# EasyEDA Pro project ProPrj_stm32的实验室报警系统设计与实现_2026-04-30.epro

# Schematic Schematic1
Assembly Variant: Basic; Board Name: Board1; Create Date: 2026-03-08; Page Name: P1; Project Name: stm32的实验室报警系统设计与实现; Schematic Name: Schematic1; Update Date: 2026-03-08; BladeWidth: 10; Company: 嘉立创EDA; Page Size: A4; RegionStart: 1; ShowBorder: 1; TitleBlock: 1; TitleBlockPosition: 3; Version: V1.0; XRegionCount: 6; YRegionCount: 4
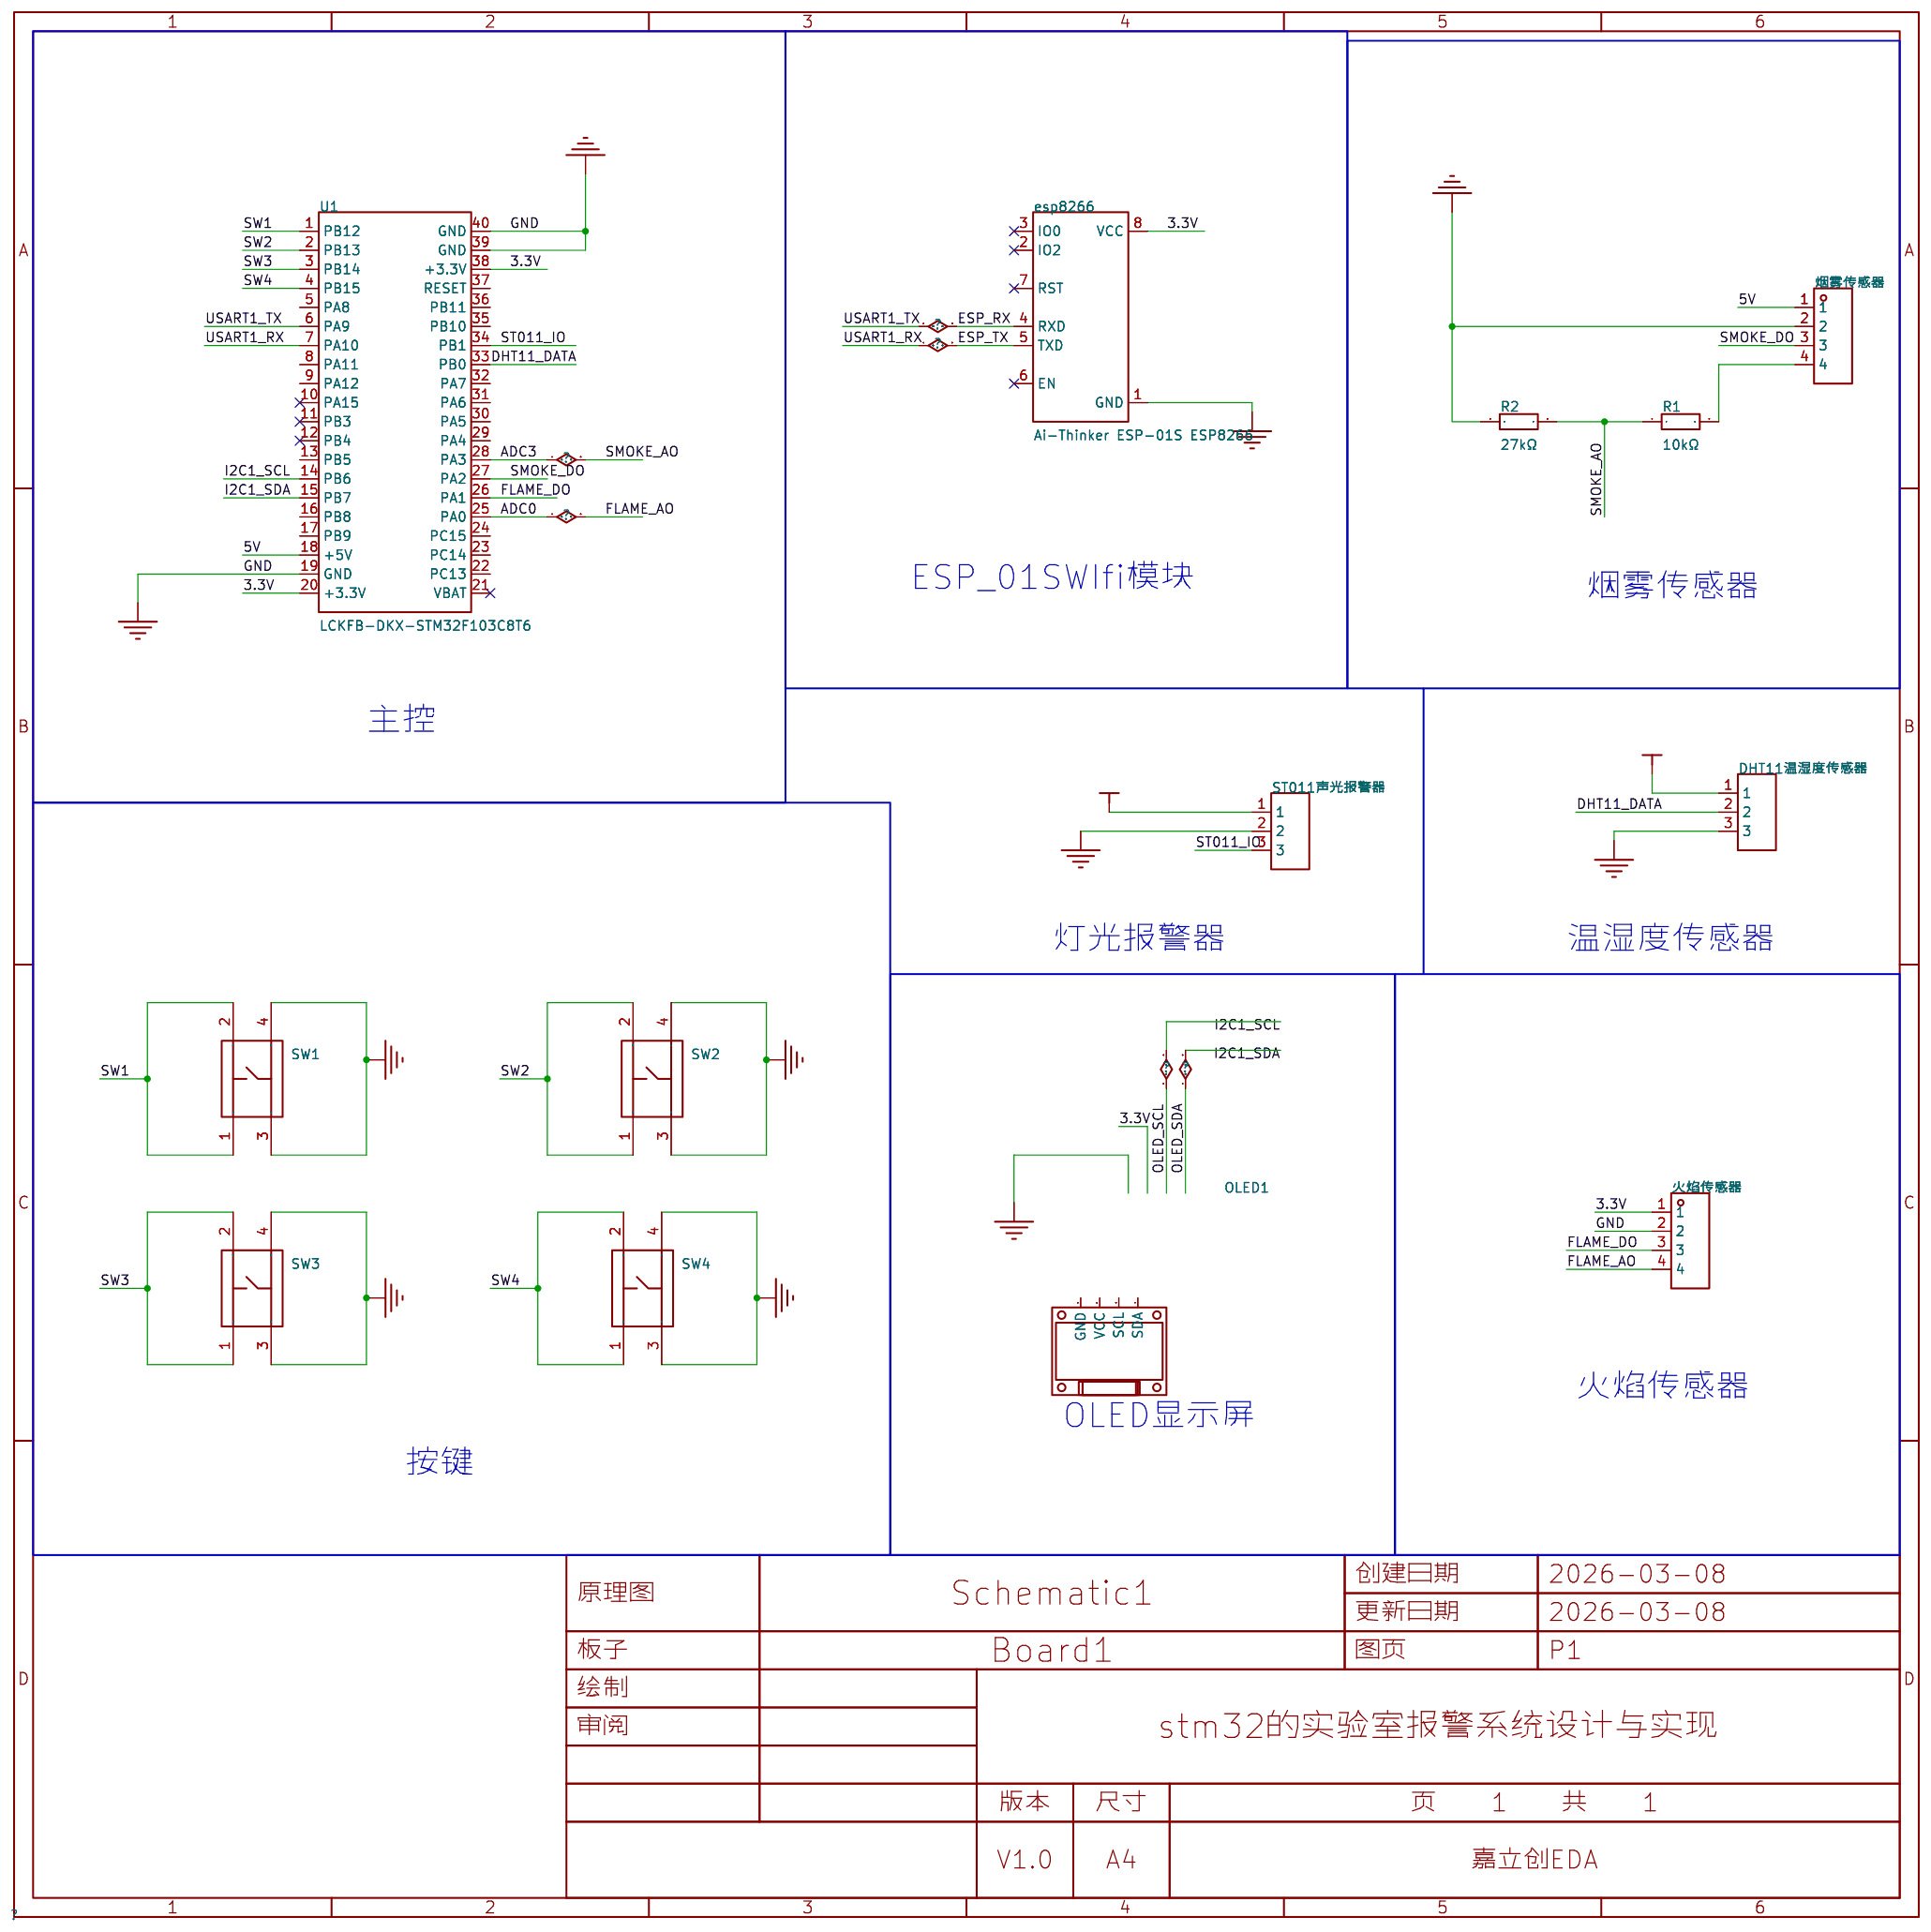
[diagram p0: schematic sheet]

## Parts
DHT11温湿度传感器  -  [HDR-TH_3P-P2.54-V-F]
esp8266  Ai-Thinker ESP-01S ESP8266  [WIFIM-TH_8P-L24.7-W14.4-P2.54]
OLED1  -  [0.96OLED_4P]
R1  10kΩ  [R0805]
R2  27kΩ  [R0805]
ST011声光报警器  -  [HDR-TH_3P-P2.54-V-F]
SW1  K2-1102DP-C4SW-04  [KEY-TH_4P-L6.0-W6.0-P4.50-LS6.50]
SW2  K2-1102DP-C4SW-04  [KEY-TH_4P-L6.0-W6.0-P4.50-LS6.50]
SW3  K2-1102DP-C4SW-04  [KEY-TH_4P-L6.0-W6.0-P4.50-LS6.50]
SW4  K2-1102DP-C4SW-04  [KEY-TH_4P-L6.0-W6.0-P4.50-LS6.50]
U1  LCKFB-DKX-STM32F103C8T6  [CONN-TH_L53.3-W22.9_STM32F103C8T6-CARD]
火焰传感器  -  [HDR-TH_4P-P2.54-V-F]
烟雾传感器  -  [HDR-TH_4P-P2.54-V-F]

## Library data of the parts
DHT11温湿度传感器 ST011声光报警器 = HDR-F_2.54_1x3P: Supplier Part: C541850; Supplier Footprint: 插件
esp8266 = Ai-Thinker ESP-01S ESP8266: Supplier Part: C17606792; Manufacturer: Ai-Thinker(安信可); JLCPCB Part Class: Extended Part; Datasheet: https://item.szlcsc.com/datasheet/Ai-Thinker%2520ESP-01S%2520ESP8266/18736031.html; Supplier: LCSC
OLED1 = 0.96OLED模块_4P: Supplier Footprint: 插件
R1 R2 = 0805W8F1002T5E_C17414: 电阻类型:厚膜电阻;阻值:10kΩ;精度:±1%;功率:125mW;工作电压:150V;温度系数:±100ppm/℃;; LCSC Part Name: 10kΩ ±1% 125mW 厚膜电阻; Supplier Part: C17414; Manufacturer: UNI-ROYAL(厚声); Manufacturer Part: 0805W8F1002T5E; Supplier Footprint: 0805; JLCPCB Part Class: Basic Part; Datasheet: https://item.szlcsc.com/datasheet/0805W8F1002T5E/18102.html; Supplier: LCSC; Type: 厚膜电阻; Tolerance: ±1%; Power(Watts): 125mW; Voltage-Supply(Max): 150V; Temperature Coefficient: ±100ppm/℃; Operating Temperature: -55℃~+155℃
SW1-SW4 = K2-1102DP-C4SW-04: 电路结构:单刀单掷;按钮形状:圆形按钮;作用力:2.5N;安装方式:直插;开关长度:6mm;开关宽度:6mm;开关高度:5mm;触点电流:50mA;额定电压:12V;带灯:-;工作寿命:10万次;; LCSC Part Name: 轻触按键开关6*6*5; Supplier Part: C110153; Manufacturer: 韩国韩荣; Supplier Footprint: 插件-4P,6x6mm; JLCPCB Part Class: Extended Part; Datasheet: https://item.szlcsc.com/datasheet/K2-1102DP-C4SW-04/111374.html; Supplier: LCSC; Circuit: 单刀单掷; Actuator Style: 圆形按钮; Operating Force: 2.5N; Mounting Type: 直插; Length: 6mm; Width: 6mm; Switch Height: 5mm; Contact Current: 50mA; Voltage Rating: 12V; Life: 10万次; Operating Temperature: -25℃~+85℃
U1 = LCKFB-DKX-STM32F103C8T6: 搭载Contex M3内核,程序存储容量64KB,RAM总容量20KB,最高72MHz主频,提供高效的计算能力和稳定的运行环境。; LCSC Part Name: 立创·地阔星-STM32F103C8T6开发板; Supplier Part: C22396880; Manufacturer: 立创开发板; JLCPCB Part Class: Extended Part; Datasheet: https://item.szlcsc.com/datasheet/LCKFB-DKX-STM32F103C8T6/24005615.html; Supplier: LCSC
火焰传感器 烟雾传感器 = HDR-F_2.54_1x4P: Supplier Part: C2718488; Supplier Footprint: 插件

## Nets
3.3V: DHT11温湿度传感器.1 esp8266.8(VCC) ST011声光报警器.1 U1.20(+3.3V) U1.38(+3.3V) 火焰传感器.1
5V: U1.18(+5V) 烟雾传感器.1
GND: DHT11温湿度传感器.3 esp8266.1(GND) R2.1 ST011声光报警器.2 SW1.3 SW1.4 SW2.3 SW2.4 SW3.3 SW3.4 SW4.3 SW4.4 U1.19(GND) U1.39(GND) U1.40(GND) 火焰传感器.2 烟雾传感器.2
ADC0: U1.25(PA0) 火焰传感器.4
ADC3: R1.1 R2.2 U1.28(PA3)
DHT11_DATA: DHT11温湿度传感器.2 U1.33(PB0)
ESP_RX: esp8266.4(RXD) U1.6(PA9)
ESP_TX: esp8266.5(TXD) U1.7(PA10)
FLAME_DO: U1.26(PA1) 火焰传感器.3
I2C1_SCL: U1.14(PB6)
I2C1_SDA: U1.15(PB7)
SMOKE_DO: U1.27(PA2) 烟雾传感器.3
ST011_IO: ST011声光报警器.3 U1.34(PB1)
SW1: SW1.1 SW1.2 U1.1(PB12)
SW2: SW2.1 SW2.2 U1.2(PB13)
SW3: SW3.1 SW3.2 U1.3(PB14)
SW4: SW4.1 SW4.2 U1.4(PB15)
$1N30: R1.2 烟雾传感器.4

Not connected (* = marked no-connect by the designer): esp8266 2(IO2)* 3(IO0)* 6(EN)* 7(RST)*; OLED1 1(GND) 2(VCC) 3(SCL) 4(SDA); U1 5(PA8) 8(PA11) 9(PA12) 10(PA15)* 11(PB3)* 12(PB4)* 13(PB5) 16(PB8) 17(PB9) 21(VBAT)* 22(PC13) 23(PC14) 24(PC15) 29(PA4) 30(PA5) 31(PA6) 32(PA7) 35(PB10) 36(PB11) 37(RESET)

## Notes on the sheet
- ESP_01SWIfi模块
- 烟雾传感器
- 主控
- 灯光报警器
- 温湿度传感器
- 火焰传感器
- OLED显示屏
- 按键

# Board PCB1
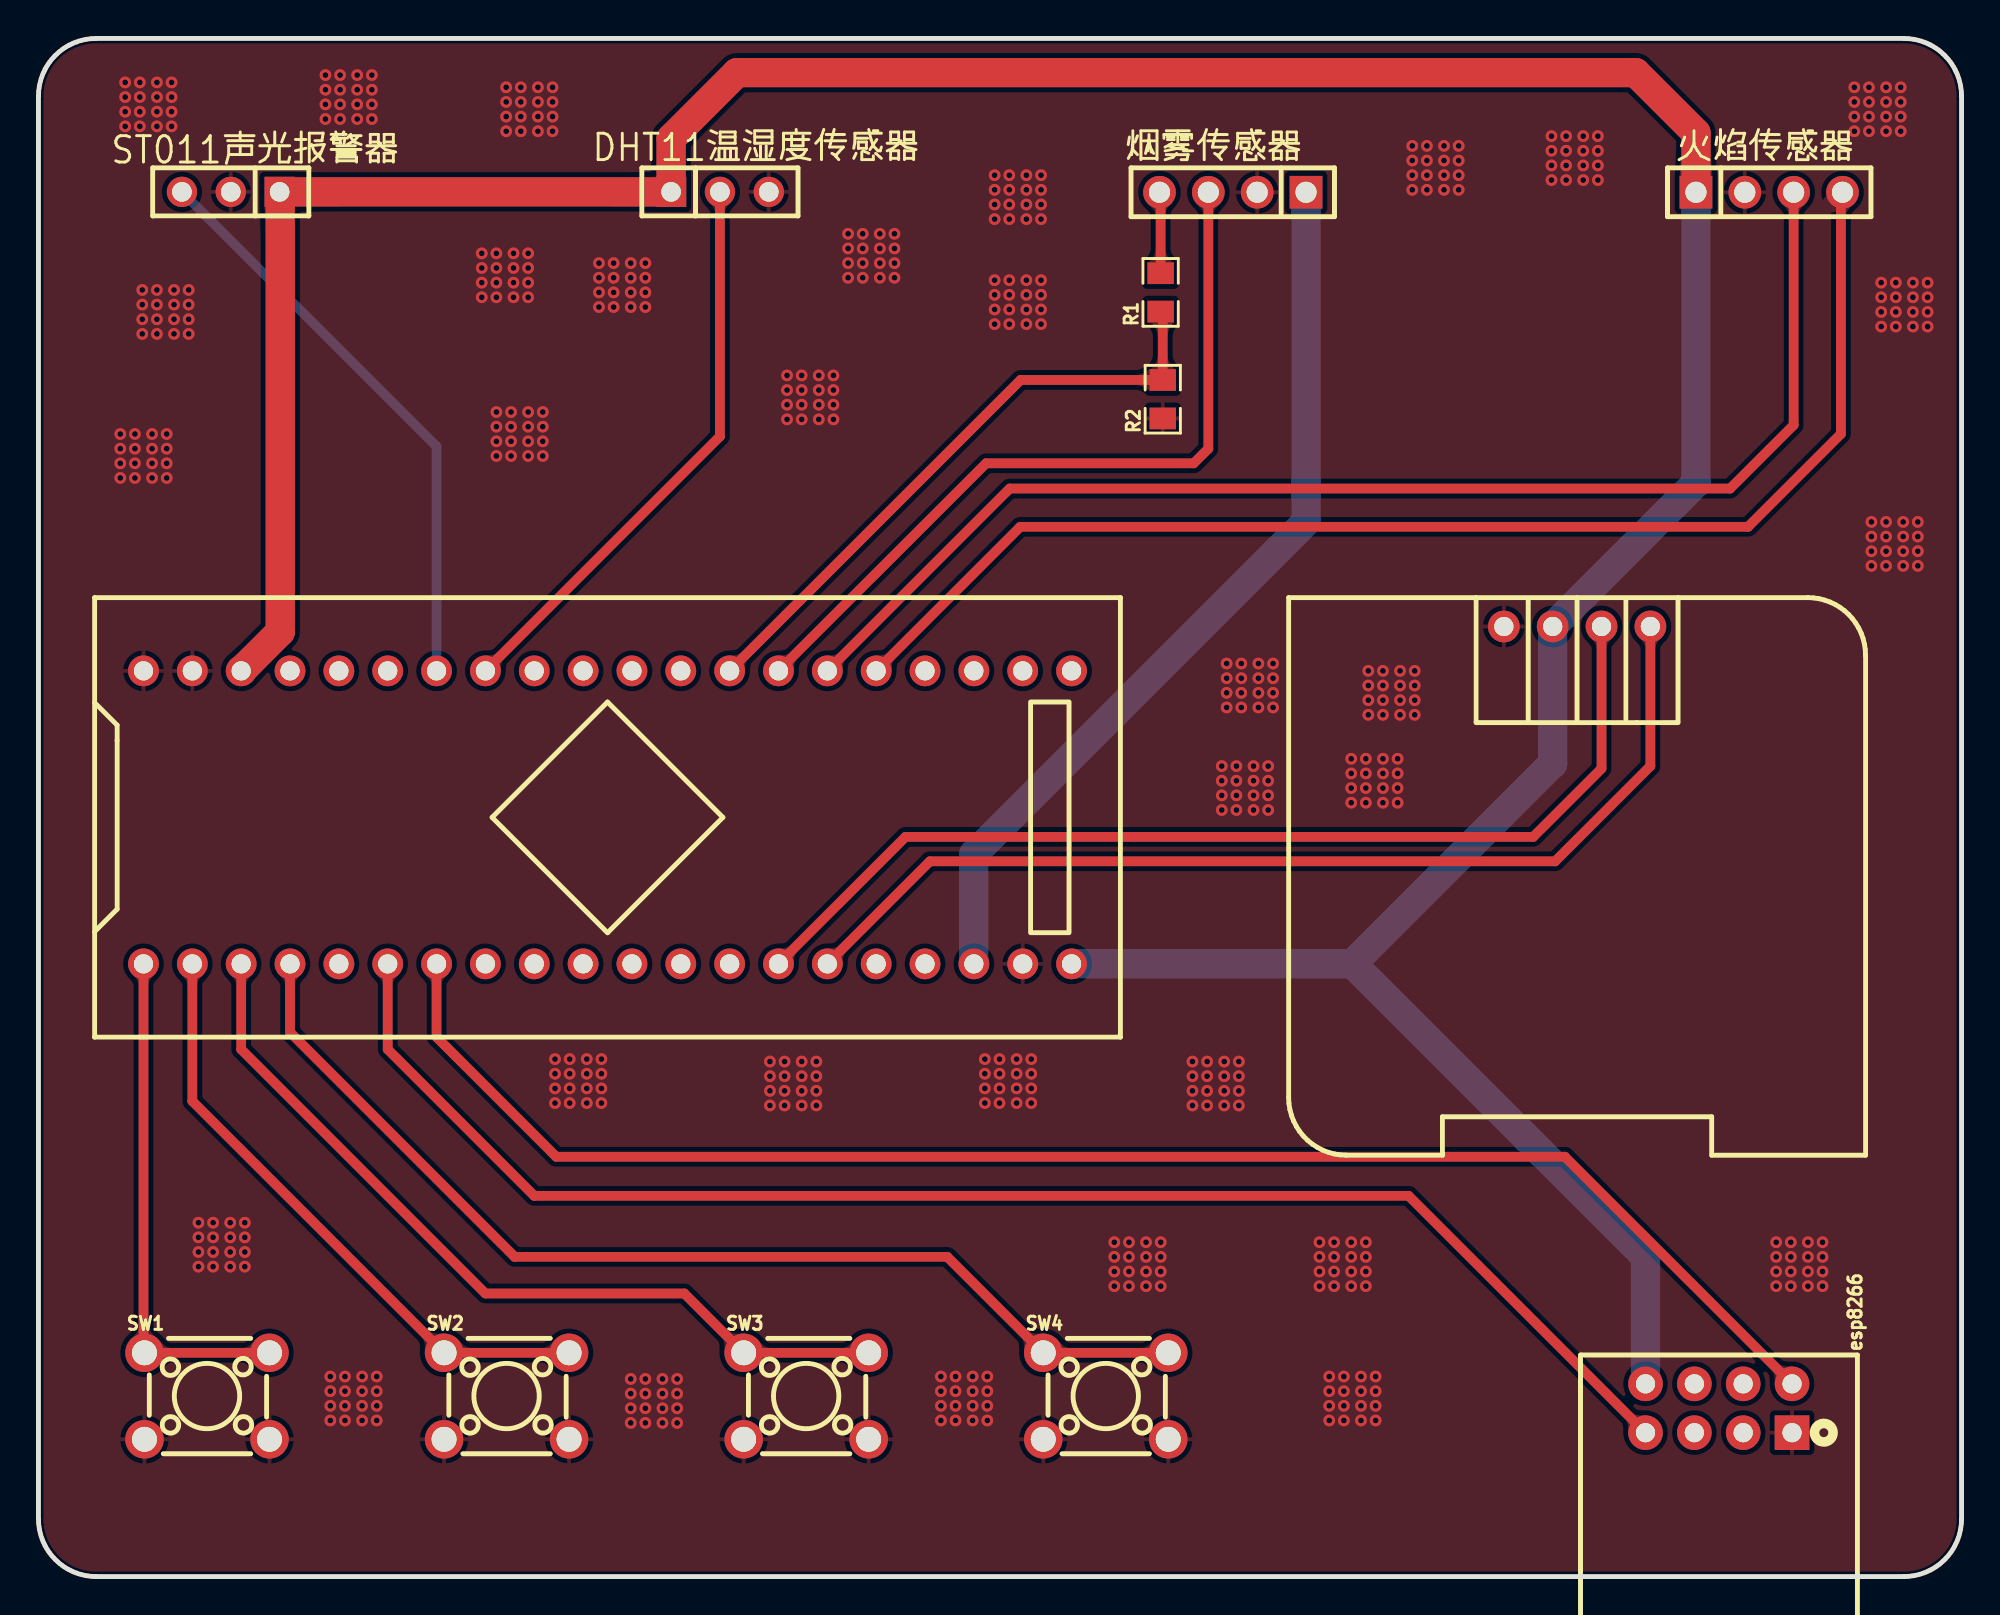
[diagram p1: board, top side]
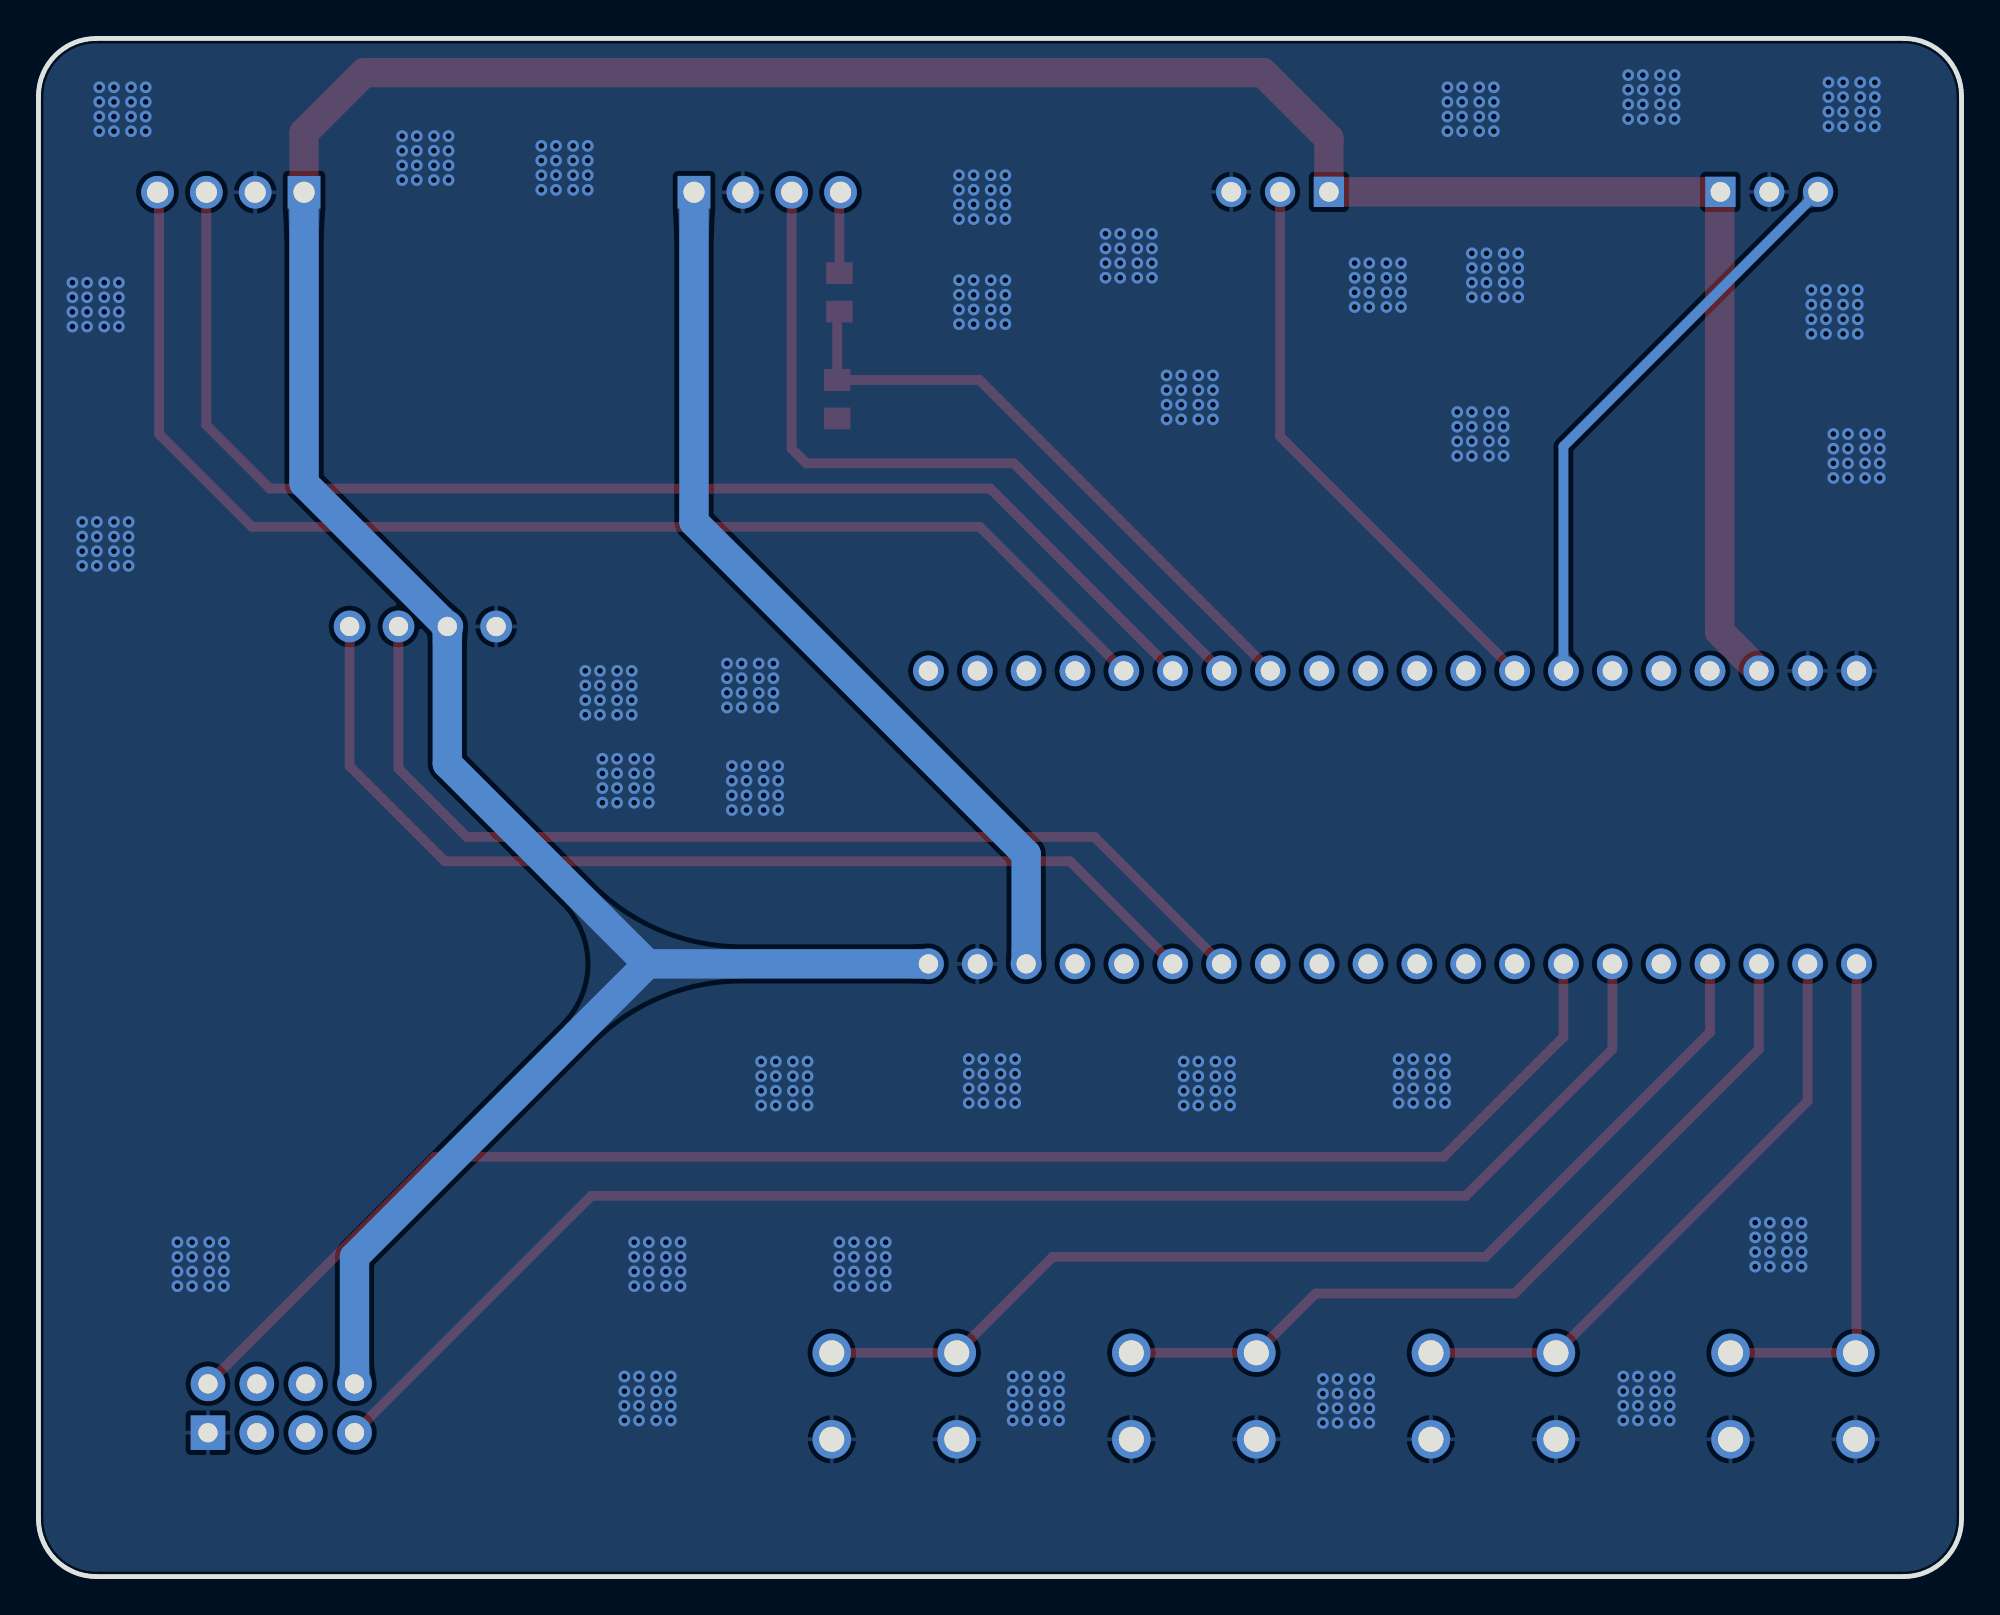
[diagram p2: board, bottom side, seen from below]

Outline 100 x 80 mm; copper layers: Top Layer, Bottom Layer. Coordinates in mm from the lower left corner of the outline.
Outline path: 0,77 0,3 arc(0.88,0.88) 3,0 97,0 arc(99.12,0.88) 100,3 100,77 arc(99.12,79.12) 97,80 3,80 arc(0.88,79.12) 0,77
Stack: Top Layer 0.035mm / Dielectric1 1.51mm FR4 er 4.5 / Bottom Layer 0.035mm

## Design rules (mm)
spacing copperThickness1oz (default): track to track 0.102, other pairs 0.152 to 0.3
spacing copperThickness2oz: track to track 0.203, other pairs 0.152 to 0.3
track width copperThickness1oz (default): min 0.127, default 0.254, max 2.54
track width copperThickness2oz: min 0.203, default 0.254, max 2.54
differential pair differentialPair (default): width min 0.127, default 0.254, max 2.54; gap min 0.152, default 0.152
net GND uses copperRegion

## Placement (name value [footprint] x y rotation side)
DHT11温湿度传感器  -  [HDR-TH_3P-P2.54-V-F]  35.44 72.02 0 top
esp8266  Ai-Thinker ESP-01S ESP8266  [WIFIM-TH_8P-L24.7-W14.4-P2.54]  87.38 8.75 270 top
OLED1  -  [0.96OLED_4P]  80.01 49.41 0 top
R1  10kΩ  [R0805]  58.35 66.79 90 top
R2  27kΩ  [R0805]  58.46 61.24 90 top
ST011声光报警器  -  [HDR-TH_3P-P2.54-V-F]  10 72.02 180 top
SW1  K2-1102DP-C4SW-04  [KEY-TH_4P-L6.0-W6.0-P4.50-LS6.50]  8.76 9.39 0 top
SW2  K2-1102DP-C4SW-04  [KEY-TH_4P-L6.0-W6.0-P4.50-LS6.50]  24.34 9.39 0 top
SW3  K2-1102DP-C4SW-04  [KEY-TH_4P-L6.0-W6.0-P4.50-LS6.50]  39.92 9.39 0 top
SW4  K2-1102DP-C4SW-04  [KEY-TH_4P-L6.0-W6.0-P4.50-LS6.50]  55.5 9.39 0 top
U1  LCKFB-DKX-STM32F103C8T6  [CONN-TH_L53.3-W22.9_STM32F103C8T6-CARD]  29.59 39.49 0 top
火焰传感器  -  [HDR-TH_4P-P2.54-V-F]  90 72 0 top
烟雾传感器  -  [HDR-TH_4P-P2.54-V-F]  62.1 72 180 top

## Footprints (pads in the part's own frame, mm; a bottom-side part is the same pattern mirrored in y, then rotated)
0.96OLED_4P
  round 1.65 hole 1: 1(-3.81,-0.002) 2(-1.27,0.002) 3(1.27,0.002) 4(3.81,0.002)
CONN-TH_L53.3-W22.9_STM32F103C8T6-CARD
  round 1.6 hole 1: 1(-24.13,-7.62) 2(-21.59,-7.62) 3(-19.05,-7.62) 4(-16.51,-7.62) 5(-13.97,-7.62) 6(-11.43,-7.62) 7(-8.89,-7.62) 8(-6.35,-7.62) 9(-3.81,-7.62) 10(-1.27,-7.62) 11(1.27,-7.62) 12(3.81,-7.62) 13(6.35,-7.62) 14(8.89,-7.62) 15(11.43,-7.62) 16(13.97,-7.62) 17(16.51,-7.62) 18(19.05,-7.62) 19(21.59,-7.62) 20(24.13,-7.62) 21(24.13,7.62) 22(21.59,7.62) 23(19.05,7.62) 24(16.51,7.62) 25(13.97,7.62) 26(11.43,7.62) 27(8.89,7.62) 28(6.35,7.62) 29(3.81,7.62) 30(1.27,7.62) 31(-1.27,7.62) 32(-3.81,7.62) 33(-6.35,7.62) 34(-8.89,7.62) 35(-11.43,7.62) 36(-13.97,7.62) 37(-16.51,7.62) 38(-19.05,7.62) 39(-21.59,7.62) 40(-24.13,7.62)
HDR-TH_3P-P2.54-V-F
  rect 1.575x1.575 hole 1.02: 1(-2.54,0)
  round 1.575 hole 1.02: 2(0,0) 3(2.54,0)
HDR-TH_4P-P2.54-V-F
  rect 1.7x1.7 hole 1.1: 1(-3.81,0)
  round 1.7 hole 1.1: 2(-1.27,0) 3(1.27,0) 4(3.81,0)
KEY-TH_4P-L6.0-W6.0-P4.50-LS6.50
  round 2 hole 1.3: 1(-3.25,2.25) 2(3.25,2.25) 3(-3.25,-2.25) 4(3.25,-2.25)
R0805
  rect 1.133x1.377 smd: 1(-1,0) 2(1,0)
WIFIM-TH_8P-L24.7-W14.4-P2.54
  rect 1.8x1.8 hole 1: 1(1.27,3.81)
  round 1.8 hole 1: 2(1.27,1.27) 3(1.27,-1.27) 4(1.27,-3.81) 5(-1.27,3.81) 6(-1.27,1.27) 7(-1.27,-1.27) 8(-1.27,-3.81)

## Nets
3.3V: DHT11温湿度传感器.1 esp8266.8 OLED1.2 ST011声光报警器.1 U1.20 U1.38 火焰传感器.1
5V: U1.18 烟雾传感器.1
GND: DHT11温湿度传感器.3 esp8266.1 OLED1.1 R2.1 ST011声光报警器.2 SW1.3 SW1.4 SW2.3 SW2.4 SW3.3 SW3.4 SW4.3 SW4.4 U1.19 U1.39 U1.40 火焰传感器.2 烟雾传感器.2
ADC0: U1.25 火焰传感器.4
ADC3: R1.1 R2.2 U1.28
DHT11_DATA: DHT11温湿度传感器.2 U1.33
ESP_RX: esp8266.4 U1.6
ESP_TX: esp8266.5 U1.7
FLAME_DO: U1.26 火焰传感器.3
I2C1_SCL: OLED1.3 U1.14
I2C1_SDA: OLED1.4 U1.15
SMOKE_DO: U1.27 烟雾传感器.3
ST011_IO: ST011声光报警器.3 U1.34
SW1: SW1.1 SW1.2 U1.1
SW2: SW2.1 SW2.2 U1.2
SW3: SW3.1 SW3.2 U1.3
SW4: SW4.1 SW4.2 U1.4
$1N30: R1.2 烟雾传感器.4

Pads without a net: esp8266 2 3 6 7; U1 5 8 9 10 11 12 13 16 17 21 22 23 24 29 30 31 32 35 36 37

## Via types
v1: diameter 0.61, hole 0.305, Top Layer to Bottom Layer, 528 vias

## Routing (per net, layer and track width the routed paths; a pad name or vN(x,y) marks a point on that pad's centre or on a via; arc(x,y) is an arc through that point)
3.3V: length 198.3
  Top Layer w1.524: 10.54,47.11 12.57,49.14 12.57,71.99 ST011声光报警器.1 DHT11温湿度传感器.1 32.9,74.8 36.32,78.22 83.06,78.22 86.19,75.09 火焰传感器.1
  Bottom Layer w1.524: 53.72,31.87 68.33,31.87 ; 68.33,31.87 78.74,42.28 OLED1.2 86.19,56.87 火焰传感器.1 ; 68.33,31.87 83.57,16.63 esp8266.8
5V: length 47.3
  Bottom Layer w1.524: 48.64,31.87 48.64,37.58 65.91,54.85 烟雾传感器.1
GND:
  vias: v1(4.25,59.43) v1(4.25,58.66) v1(4.25,57.9) v1(4.25,57.14) v1(4.51,77.71) v1(4.51,76.95) v1(4.51,76.19) v1(4.51,75.43) v1(5.02,59.43) v1(5.02,58.66) v1(5.02,57.9) v1(5.02,57.14) v1(5.27,77.71) v1(5.27,76.95) v1(5.27,76.19) v1(5.27,75.43) v1(5.4,66.92) v1(5.4,66.16) v1(5.4,65.39) v1(5.4,64.63) v1(5.91,59.43) v1(5.91,58.66) v1(5.91,57.9) v1(5.91,57.14) v1(6.16,77.71) v1(6.16,76.95) v1(6.16,76.19) v1(6.16,75.43) v1(6.16,66.92) v1(6.16,66.16) v1(6.16,65.39) v1(6.16,64.63) v1(6.67,59.43) v1(6.67,58.66) v1(6.67,57.9) v1(6.67,57.14) v1(6.92,77.71) v1(6.92,76.95) v1(6.92,76.19) v1(6.92,75.43) v1(7.05,66.92) v1(7.05,66.16) v1(7.05,65.39) v1(7.05,64.63) v1(7.81,66.92) v1(7.81,66.16) v1(7.81,65.39) v1(7.81,64.63) v1(8.32,18.41) v1(8.32,17.64) v1(8.32,16.88) v1(8.32,16.12) v1(9.08,18.41) v1(9.08,17.64) v1(9.08,16.88) v1(9.08,16.12) v1(9.97,18.41) v1(9.97,17.64) v1(9.97,16.88) v1(9.97,16.12) v1(10.73,18.41) v1(10.73,17.64) v1(10.73,16.88) v1(10.73,16.12) v1(14.92,78.09) v1(14.92,77.33) v1(14.92,76.57) v1(14.92,75.81) v1(15.18,10.4) v1(15.18,9.64) v1(15.18,8.88) v1(15.18,8.12) v1(15.68,78.09) v1(15.68,77.33) v1(15.68,76.57) v1(15.68,75.81) v1(15.94,10.4) v1(15.94,9.64) v1(15.94,8.88) v1(15.94,8.12) v1(16.57,78.09) v1(16.57,77.33) v1(16.57,76.57) v1(16.57,75.81) v1(16.83,10.4) v1(16.83,9.64) v1(16.83,8.88) v1(16.83,8.12) v1(17.34,78.09) v1(17.34,77.33) v1(17.34,76.57) v1(17.34,75.81) v1(17.59,10.4) v1(17.59,9.64) v1(17.59,8.88) v1(17.59,8.12) v1(23.05,68.82) v1(23.05,68.06) v1(23.05,67.3) v1(23.05,66.54) v1(23.81,68.82) v1(23.81,68.06) v1(23.81,67.3) v1(23.81,66.54) v1(23.81,60.57) v1(23.81,59.81) v1(23.81,59.05) v1(23.81,58.28) v1(24.32,77.46) v1(24.32,76.7) v1(24.32,75.94) v1(24.32,75.17) v1(24.57,60.57) v1(24.57,59.81) v1(24.57,59.05) v1(24.57,58.28) v1(24.7,68.82) v1(24.7,68.06) v1(24.7,67.3) v1(24.7,66.54) v1(25.08,77.46) v1(25.08,76.7) v1(25.08,75.94) v1(25.08,75.17) v1(25.46,68.82) v1(25.46,68.06) v1(25.46,67.3) v1(25.46,66.54) v1(25.46,60.57) v1(25.46,59.81) v1(25.46,59.05) v1(25.46,58.28) v1(25.97,77.46) v1(25.97,76.7) v1(25.97,75.94) v1(25.97,75.17) v1(26.23,60.57) v1(26.23,59.81) v1(26.23,59.05) v1(26.23,58.28) v1(26.73,77.46) v1(26.73,76.7) v1(26.73,75.94) v1(26.73,75.17) v1(26.86,26.91) v1(26.86,26.15) v1(26.86,25.39) v1(26.86,24.63) v1(27.62,26.91) v1(27.62,26.15) v1(27.62,25.39) v1(27.62,24.63) v1(28.51,26.91) v1(28.51,26.15) v1(28.51,25.39) v1(28.51,24.63) v1(29.15,68.32) v1(29.15,67.55) v1(29.15,66.79) v1(29.15,66.03) v1(29.27,26.91) v1(29.27,26.15) v1(29.27,25.39) v1(29.27,24.63) v1(29.91,68.32) v1(29.91,67.55) v1(29.91,66.79) v1(29.91,66.03) v1(30.8,68.32) v1(30.8,67.55) v1(30.8,66.79) v1(30.8,66.03) v1(30.8,10.28) v1(30.8,9.51) v1(30.8,8.75) v1(30.8,7.99) v1(31.56,68.32) v1(31.56,67.55) v1(31.56,66.79) v1(31.56,66.03) v1(31.56,10.28) v1(31.56,9.51) v1(31.56,8.75) v1(31.56,7.99) v1(32.45,10.28) v1(32.45,9.51) v1(32.45,8.75) v1(32.45,7.99) v1(33.21,10.28) v1(33.21,9.51) v1(33.21,8.75) v1(33.21,7.99) v1(38.04,26.79) v1(38.04,26.03) v1(38.04,25.26) v1(38.04,24.5) v1(38.8,26.79) v1(38.8,26.03) v1(38.8,25.26) v1(38.8,24.5) v1(38.93,62.47) v1(38.93,61.71) v1(38.93,60.95) v1(38.93,60.19) v1(39.69,62.47) v1(39.69,61.71) v1(39.69,60.95) v1(39.69,60.19) v1(39.69,26.79) v1(39.69,26.03) v1(39.69,25.26) v1(39.69,24.5) v1(40.45,26.79) v1(40.45,26.03) v1(40.45,25.26) v1(40.45,24.5) v1(40.58,62.47) v1(40.58,61.71) v1(40.58,60.95) v1(40.58,60.19) v1(41.34,62.47) v1(41.34,61.71) v1(41.34,60.95) v1(41.34,60.19) v1(42.1,69.84) v1(42.1,69.08) v1(42.1,68.32) v1(42.1,67.55) v1(42.86,69.84) v1(42.86,69.08) v1(42.86,68.32) v1(42.86,67.55) v1(43.75,69.84) v1(43.75,69.08) v1(43.75,68.32) v1(43.75,67.55) v1(44.51,69.84) v1(44.51,69.08) v1(44.51,68.32) v1(44.51,67.55) v1(46.93,10.4) v1(46.93,9.64) v1(46.93,8.88) v1(46.93,8.12) v1(47.69,10.4) v1(47.69,9.64) v1(47.69,8.88) v1(47.69,8.12) v1(48.58,10.4) v1(48.58,9.64) v1(48.58,8.88) v1(48.58,8.12) v1(49.21,26.91) v1(49.21,26.15) v1(49.21,25.39) v1(49.21,24.63) v1(49.34,10.4) v1(49.34,9.64) v1(49.34,8.88) v1(49.34,8.12) v1(49.72,72.89) v1(49.72,72.13) v1(49.72,71.36) v1(49.72,70.6) v1(49.72,67.43) v1(49.72,66.67) v1(49.72,65.9) v1(49.72,65.14) v1(49.97,26.91) v1(49.97,26.15) v1(49.97,25.39) v1(49.97,24.63) v1(50.48,72.89) v1(50.48,72.13) v1(50.48,71.36) v1(50.48,70.6) v1(50.48,67.43) v1(50.48,66.67) v1(50.48,65.9) v1(50.48,65.14) v1(50.86,26.91) v1(50.86,26.15) v1(50.86,25.39) v1(50.86,24.63) v1(51.37,72.89) v1(51.37,72.13) v1(51.37,71.36) v1(51.37,70.6) v1(51.37,67.43) v1(51.37,66.67) v1(51.37,65.9) v1(51.37,65.14) v1(51.63,26.91) v1(51.63,26.15) v1(51.63,25.39) v1(51.63,24.63) v1(52.13,72.89) v1(52.13,72.13) v1(52.13,71.36) v1(52.13,70.6) v1(52.13,67.43) v1(52.13,66.67) v1(52.13,65.9) v1(52.13,65.14) v1(55.94,17.39) v1(55.94,16.63) v1(55.94,15.87) v1(55.94,15.1) v1(56.71,17.39) v1(56.71,16.63) v1(56.71,15.87) v1(56.71,15.1) v1(57.59,17.39) v1(57.59,16.63) v1(57.59,15.87) v1(57.59,15.1) v1(58.36,17.39) v1(58.36,16.63) v1(58.36,15.87) v1(58.36,15.1) v1(60.01,26.79) v1(60.01,26.03) v1(60.01,25.26) v1(60.01,24.5) v1(60.77,26.79) v1(60.77,26.03) v1(60.77,25.26) v1(60.77,24.5) v1(61.53,42.15) v1(61.53,41.39) v1(61.53,40.63) v1(61.53,39.87) v1(61.66,26.79) v1(61.66,26.03) v1(61.66,25.26) v1(61.66,24.5) v1(61.79,47.49) v1(61.79,46.73) v1(61.79,45.96) v1(61.79,45.2) v1(62.29,42.15) v1(62.29,41.39) v1(62.29,40.63) v1(62.29,39.87) v1(62.42,26.79) v1(62.42,26.03) v1(62.42,25.26) v1(62.42,24.5) v1(62.55,47.49) v1(62.55,46.73) v1(62.55,45.96) v1(62.55,45.2) v1(63.18,42.15) v1(63.18,41.39) v1(63.18,40.63) v1(63.18,39.87) v1(63.44,47.49) v1(63.44,46.73) v1(63.44,45.96) v1(63.44,45.2) v1(63.94,42.15) v1(63.94,41.39) v1(63.94,40.63) v1(63.94,39.87) v1(64.2,47.49) v1(64.2,46.73) v1(64.2,45.96) v1(64.2,45.2) v1(66.61,17.39) v1(66.61,16.63) v1(66.61,15.87) v1(66.61,15.1) v1(67.12,10.4) v1(67.12,9.64) v1(67.12,8.88) v1(67.12,8.12) v1(67.37,17.39) v1(67.37,16.63) v1(67.37,15.87) v1(67.37,15.1) v1(67.88,10.4) v1(67.88,9.64) v1(67.88,8.88) v1(67.88,8.12) v1(68.26,42.53) v1(68.26,41.77) v1(68.26,41.01) v1(68.26,40.25) v1(68.26,17.39) v1(68.26,16.63) v1(68.26,15.87) v1(68.26,15.1) v1(68.77,10.4) v1(68.77,9.64) v1(68.77,8.88) v1(68.77,8.12) v1(69.02,42.53) v1(69.02,41.77) v1(69.02,41.01) v1(69.02,40.25) v1(69.02,17.39) v1(69.02,16.63) v1(69.02,15.87) v1(69.02,15.1) v1(69.15,47.11) v1(69.15,46.34) v1(69.15,45.58) v1(69.15,44.82) v1(69.53,10.4) v1(69.53,9.64) v1(69.53,8.88) v1(69.53,8.12) v1(69.91,47.11) v1(69.91,46.34) v1(69.91,45.58) v1(69.91,44.82) v1(69.91,42.53) v1(69.91,41.77) v1(69.91,41.01) v1(69.91,40.25) v1(70.68,42.53) v1(70.68,41.77) v1(70.68,41.01) v1(70.68,40.25) v1(70.8,47.11) v1(70.8,46.34) v1(70.8,45.58) v1(70.8,44.82) v1(71.44,74.41) v1(71.44,73.65) v1(71.44,72.89) v1(71.44,72.13) v1(71.56,47.11) v1(71.56,46.34) v1(71.56,45.58) v1(71.56,44.82) v1(72.2,74.41) v1(72.2,73.65) v1(72.2,72.89) v1(72.2,72.13) v1(73.09,74.41) v1(73.09,73.65) v1(73.09,72.89) v1(73.09,72.13) v1(73.85,74.41) v1(73.85,73.65) v1(73.85,72.89) v1(73.85,72.13) v1(78.68,74.92) v1(78.68,74.16) v1(78.68,73.4) v1(78.68,72.63) v1(79.44,74.92) v1(79.44,74.16) v1(79.44,73.4) v1(79.44,72.63) v1(80.33,74.92) v1(80.33,74.16) v1(80.33,73.4) v1(80.33,72.63) v1(81.09,74.92) v1(81.09,74.16) v1(81.09,73.4) v1(81.09,72.63) v1(90.36,17.39) v1(90.36,16.63) v1(90.36,15.87) v1(90.36,15.1) v1(91.12,17.39) v1(91.12,16.63) v1(91.12,15.87) v1(91.12,15.1) v1(92.01,17.39) v1(92.01,16.63) v1(92.01,15.87) v1(92.01,15.1) v1(92.77,17.39) v1(92.77,16.63) v1(92.77,15.87) v1(92.77,15.1) v1(94.42,77.46) v1(94.42,76.7) v1(94.42,75.94) v1(94.42,75.17) v1(95.19,77.46) v1(95.19,76.7) v1(95.19,75.94) v1(95.19,75.17) v1(95.31,54.85) v1(95.31,54.09) v1(95.31,53.33) v1(95.31,52.57) v1(95.82,67.3) v1(95.82,66.54) v1(95.82,65.78) v1(95.82,65.01) v1(96.08,77.46) v1(96.08,76.7) v1(96.08,75.94) v1(96.08,75.17) v1(96.08,54.85) v1(96.08,54.09) v1(96.08,53.33) v1(96.08,52.57) v1(96.58,67.3) v1(96.58,66.54) v1(96.58,65.78) v1(96.58,65.01) v1(96.84,77.46) v1(96.84,76.7) v1(96.84,75.94) v1(96.84,75.17) v1(96.96,54.85) v1(96.96,54.09) v1(96.96,53.33) v1(96.96,52.57) v1(97.47,67.3) v1(97.47,66.54) v1(97.47,65.78) v1(97.47,65.01) v1(97.73,54.85) v1(97.73,54.09) v1(97.73,53.33) v1(97.73,52.57) v1(98.23,67.3) v1(98.23,66.54) v1(98.23,65.78) v1(98.23,65.01)
ADC0: length 67.9
  Top Layer w0.508: 火焰传感器.4 93.73,71.92 93.73,59.43 88.9,54.6 51.05,54.6 U1.25
ADC3: length 32.4
  Top Layer w0.508: R1.1 58.46,65.68 R2.2 51.07,62.24 U1.28
DHT11_DATA: length 30
  Top Layer w0.508: 23.24,47.11 35.44,59.3 DHT11温湿度传感器.2
ESP_RX: length 78.1
  Top Layer w0.508: 18.16,31.87 18.16,27.42 25.78,19.8 71.25,19.8 83.57,7.48
ESP_TX: length 81.8
  Top Layer w0.508: esp8266.5 79.38,21.83 26.92,21.83 20.7,28.06 20.7,31.87
FLAME_DO: length 67.7
  Top Layer w0.508: 41.02,47.11 50.5,56.59 87.97,56.59 91.27,59.89 火焰传感器.3
I2C1_SCL: length 54.4
  Top Layer w0.508: 38.48,31.87 45.09,38.47 77.72,38.47 81.28,42.03 OLED1.3
I2C1_SDA: length 54.3
  Top Layer w0.508: OLED1.4 83.82,42.15 78.87,37.2 46.35,37.2 41.02,31.87
SMOKE_DO: length 40.5
  Top Layer w0.508: U1.27 49.28,57.9 60.07,57.9 60.83,58.66 烟雾传感器.3
ST011_IO: length 30.4
  Bottom Layer w0.508: ST011声光报警器.3 20.7,58.78 20.7,47.11
SW1: length 26.8
  Top Layer w0.508: SW1.2 SW1.1 5.46,11.69 5.46,31.87
SW2: length 32.2
  Top Layer w0.508: SW2.2 SW2.1 8,24.73 8,31.87
SW3: length 43.6
  Top Layer w0.508: 10.54,31.87 10.54,27.42 23.24,14.72 33.59,14.72 SW3.1 SW3.2
SW4: length 56.1
  Top Layer w0.508: 13.08,31.87 13.08,28.31 24.77,16.63 47.26,16.63 SW4.1 SW4.2
$1N30: length 4.2
  Top Layer w0.508: 烟雾传感器.4 58.35,71.94 R1.2

## Copper pours and planes (outline as drawn; the poured copper is in the pictures)
GND on Top Layer: -14.86,110.48 132.59,110.48 132.59,-45.22 -14.86,-45.22
GND on Bottom Layer: -19.94,111.37 115.32,111.37 115.32,-34.3 -19.94,-34.3

Small or netless copper shapes (teardrops, artwork), in the pictures only: 45 on Top Layer, 10 on Bottom Layer
